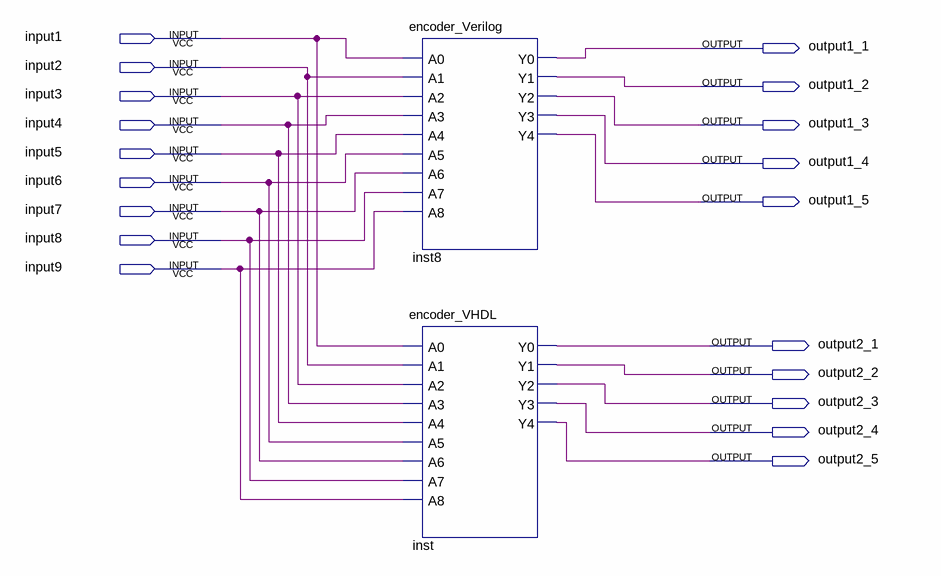
[diagram p0: schematic sheet]
// Quartus schematic lab4_encoder_block.bdf as structural Verilog: 2 symbols, 19 pins
module lab4_encoder_block (
  input  input1,
  input  input2,
  input  input3,
  input  input4,
  input  input5,
  input  input6,
  input  input7,
  input  input8,
  input  input9,
  output output1_1,
  output output1_2,
  output output1_3,
  output output1_4,
  output output1_5,
  output output2_1,
  output output2_2,
  output output2_3,
  output output2_4,
  output output2_5
);

  encoder_Verilog inst8 (
    .A0(input1), .A1(input2), .A2(input3), .A3(input4), .A4(input5), .A5(input6), .A6(input7), .A7(input8),
    .A8(input9), .Y0(output1_1), .Y1(output1_2), .Y2(output1_3), .Y3(output1_4), .Y4(output1_5));
  encoder_VHDL inst (
    .A0(input1), .A1(input2), .A2(input3), .A3(input4), .A4(input5), .A5(input6), .A6(input7), .A7(input8),
    .A8(input9), .Y0(output2_1), .Y1(output2_2), .Y2(output2_3), .Y3(output2_4), .Y4(output2_5));
endmodule
